# EAGLE design FCF_v2 (EAGLE 7.1.0)
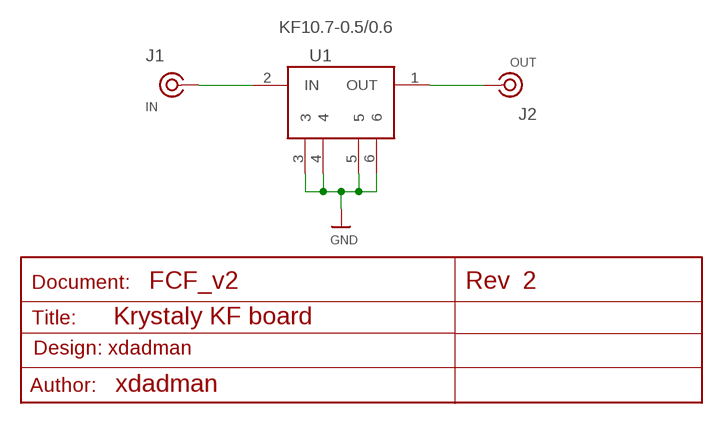
[diagram p0: schematic, sheet 1]

## Parts
J1  IN  COAX  [SLIM_COAX_PAD]
J2  OUT  COAX  [SLIM_COAX_PAD]
U1  KF10.7-0.5/0.6  [KF-17]

## Nets
GND: U1.3 U1.4 U1.5 U1.6
N$1 [50hm]: J1.SIG U1.2(IN)
N$2 [50hm]: J2.SIG U1.1(OUT)

## Notes on the sheet
- 2
- Krystaly KF board
- Design: xdadman
- xdadman

## Power pins joined to a net without a drawn wire
GND: J1.GND J2.GND

## Library data of the parts
J1 J2 = MSA_lib:COAX
U1 = MSA_lib:KF10.7-0.5/0.6: Krystaly 10.7 Crystal filter

## Net classes
1 50hm: clearance 0.26 mm

## Board

Size 40 x 32 mm. Coordinates in mm from the lower left corner, seen from the top.
Outline: 0,0 40,0 40,32 0,32 0,0
Copper layers (1*16): Top 0.035mm / dielectric 1.5mm / Bottom 0.035mm
Design rules "kuba_no_CLR *": minimum track width 8mil, minimum drill 15mil, track to track 8mil, track to pad 8mil, pad to pad 8mil, via to via 8mil, smd to smd 8mil, copper to edge 0mil, drill to drill 8mil, minimum pad ring 12mil, minimum via ring 10mil, stop-mask expansion 4mil, vias tented up to drill 0mil, thermal gap 10mil

### Footprints (pad centres in the part's own frame; a part is rotated, then mirrored left to right if it is on the bottom)
SLIM_COAX_PAD = smd 1.27 x 0.635 bottom: GND 0,-2.667 | drill 1.1: SIG 0,0
KF-17 = drill 1.1: 1 -16,5; 2 16,5; 3 -16,1; 4 -12,5; 5 12,5; 6 16,1

### Placement (x,y rotation side)
J1  33,7 0 top
J2  7,7 0 top
U1  20,22 180 bottom

### Tracks (layer width: path | path; a pad name or v marks a point on that pad's centre or on a via)
GND  (via drill 0.5)
  other vias: 21,2 19,2 19,3.24 19,4.48 19,5.71 19,6.95 19,8.19 19,14 19,15.24 19,16.48 19,17.71 19,18.7 19,24 19,26 19,28 21,4.51 21,5.75 21,6.98 21,9.24 21,10.48 21,11.46 21,16 21,16.98 21,18.22 21,19.49 21,23.94 21,25.97 21,28 20.02,2.51 20.02,3.78 20.02,5.05 20.02,6.32 20.02,7.59 21,3.24 21,8.22 19.98,8.73 18.97,9.49 19.98,10 18.97,10.76 18.97,12.03 18.97,13.05 19.98,11.27 19.98,12.54 19.98,13.56 19.98,14.57 21,12.48 21,13.75 21,15.02 19.98,15.78 19.98,17.05 19.98,18.06 19.98,19.33 19.98,20.35 19.98,21.37 18.97,19.84 18.97,21.11 18.97,22.13 21,20.6 21,21.87 19,22.98 19,25.02 19,27.05 19,29.08 21,29.02 21,26.98 21,24.95 21,22.92 19.98,22.41 19.98,23.43 19.98,24.45 19.98,25.46 19.98,26.48 19.98,27.49 19.98,28.51 19.98,29.52 5.79,15.72 6.05,14.45 7.06,13.43 8.08,12.41 8.84,11.14 8.84,9.62 9.6,8.1 9.86,6.32 9.09,5.05 2.24,15.72 1.98,13.94 3,12.41 4.27,11.4 5.28,10.13 4.78,8.6 4.27,6.83 5.28,4.79 7.32,4.29 6.05,17.24 5.28,18.76 3,18.76 1.98,17.49 35.73,19.27 34.46,18.51 33.95,16.99 32.94,13.18 31.92,12.16 31.41,10.64 31.41,9.11 30.4,7.08 30.91,5.3 32.94,4.29 35.22,5.05 35.73,7.33 34.72,9.11 34.72,10.38 35.73,11.4 37.76,13.68 37.76,15.21 38.27,17.24 37.26,18.76 33.95,14.45 34.46,15.72 36.75,12.41
  pour Top: 0,0 40,0 40,32 0,32
  pour Bottom: 0,0 40,0 40,32 0,32
N$1
  Top 1.2: U1.2 36,14 33,11 J1.SIG
N$2
  Top 1.2: U1.1 4,14 7,11 J2.SIG

### Text on the board
tPlace: Final Crystal Filter | U1 - KF 17 | J2 - INPUT | J1 - OUTPUT